# Altium schematic sheet power_switches.SchDoc
size A4
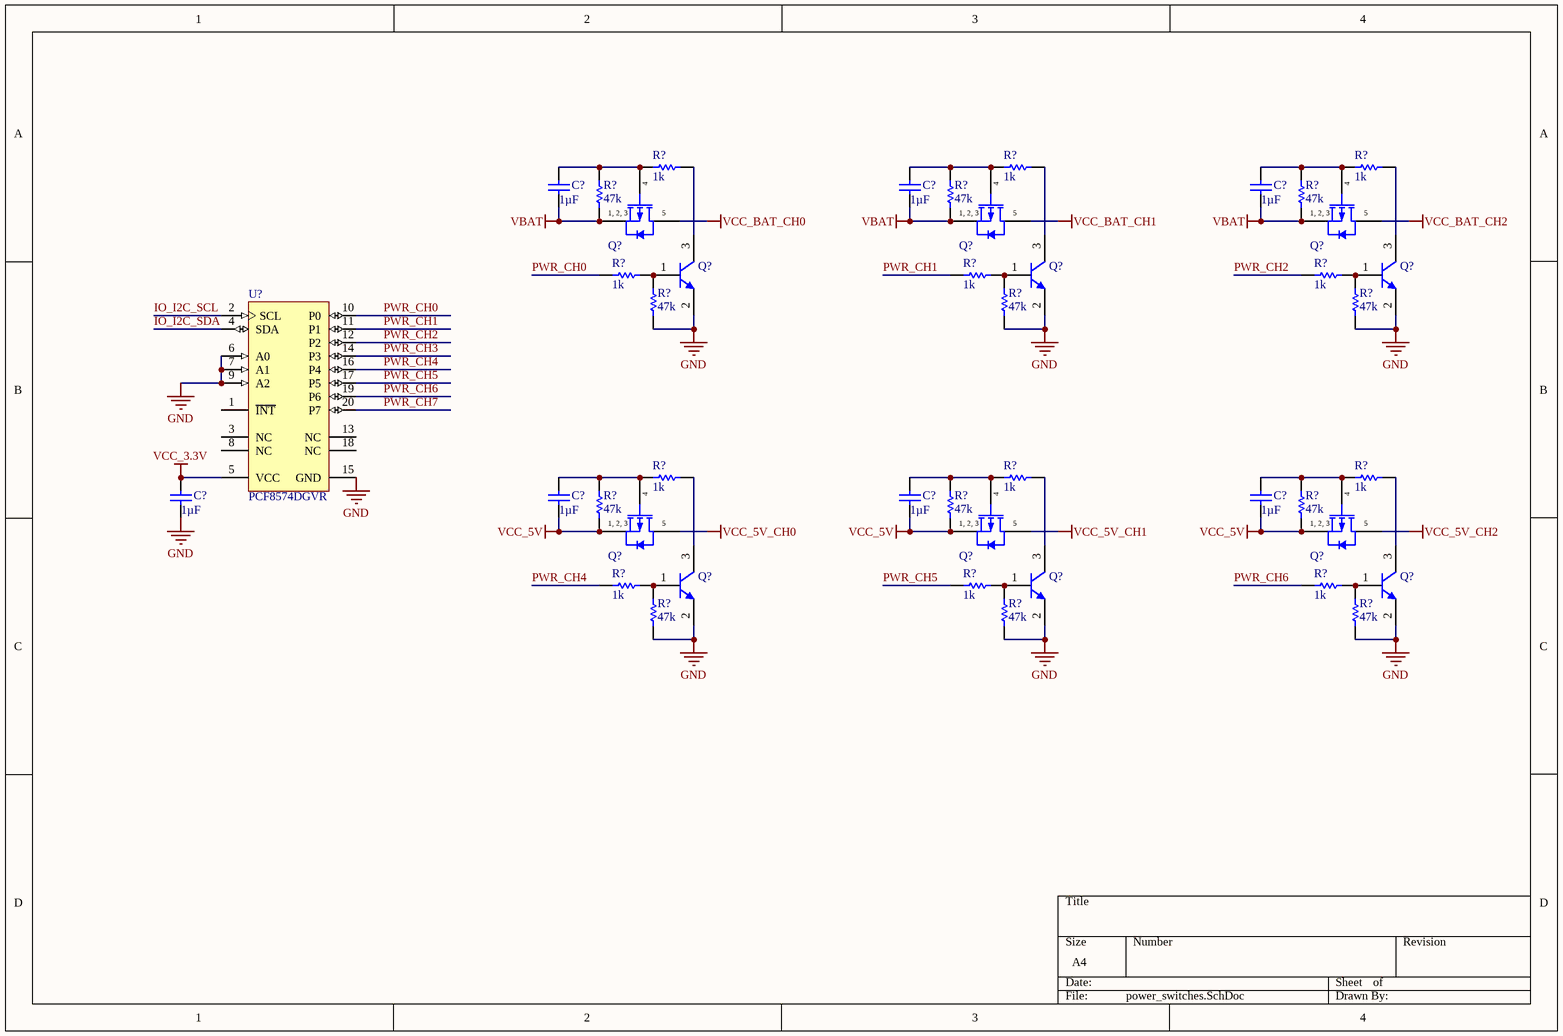
[diagram p0: power_switches.SchDoc]

## Parts
(Parts that share a designator on the sheet are numbered #1, #2 ... from top to bottom, then left to right.)
C?#1  1µF  [CAPC1608X90X35LL15T15]
C?#2  1µF  [CAPC1608X90X35LL15T15]
C?#3  1µF  [CAPC1608X90X35LL15T15]
C?#4  1µF  [CAPC1608X90X35LL15T15]
C?#5  1µF  [CAPC1608X90X35LL15T15]
C?#6  1µF  [CAPC1608X90X35LL15T15]
C?#7  1µF  [CAPC1608X90X35LL15T15]
Q?#1  Vishay SI7149ADP-T1-GE3  [PCB-zhz9tig7820limf6j70v-1]  (value not drawn)
Q?#2  Vishay SI7149ADP-T1-GE3  [PCB-zhz9tig7820limf6j70v-1]  (value not drawn)
Q?#3  Vishay SI7149ADP-T1-GE3  [PCB-zhz9tig7820limf6j70v-1]  (value not drawn)
Q?#4  SMMBT4401LT1G  [ONSC-SOT-23-3-318-08_V]  (value not drawn)
Q?#5  SMMBT4401LT1G  [ONSC-SOT-23-3-318-08_V]  (value not drawn)
Q?#6  SMMBT4401LT1G  [ONSC-SOT-23-3-318-08_V]  (value not drawn)
Q?#7  Vishay SI7149ADP-T1-GE3  [PCB-zhz9tig7820limf6j70v-1]  (value not drawn)
Q?#8  Vishay SI7149ADP-T1-GE3  [PCB-zhz9tig7820limf6j70v-1]  (value not drawn)
Q?#9  Vishay SI7149ADP-T1-GE3  [PCB-zhz9tig7820limf6j70v-1]  (value not drawn)
Q?#10  SMMBT4401LT1G  [ONSC-SOT-23-3-318-08_V]  (value not drawn)
Q?#11  SMMBT4401LT1G  [ONSC-SOT-23-3-318-08_V]  (value not drawn)
Q?#12  SMMBT4401LT1G  [ONSC-SOT-23-3-318-08_V]  (value not drawn)
R?#1  1k  [PCB-imsgvtunp3nvnj2wzwbs-1]
R?#2  1k  [PCB-imsgvtunp3nvnj2wzwbs-1]
R?#3  1k  [PCB-imsgvtunp3nvnj2wzwbs-1]
R?#4  47k  [RESC1005X40X25LL05T10]
R?#5  47k  [RESC1005X40X25LL05T10]
R?#6  47k  [RESC1005X40X25LL05T10]
R?#7  1k  [PCB-imsgvtunp3nvnj2wzwbs-1]
R?#8  1k  [PCB-imsgvtunp3nvnj2wzwbs-1]
R?#9  1k  [PCB-imsgvtunp3nvnj2wzwbs-1]
R?#10  47k  [RESC1005X40X25LL05T10]
R?#11  47k  [RESC1005X40X25LL05T10]
R?#12  47k  [RESC1005X40X25LL05T10]
R?#13  1k  [PCB-imsgvtunp3nvnj2wzwbs-1]
R?#14  1k  [PCB-imsgvtunp3nvnj2wzwbs-1]
R?#15  1k  [PCB-imsgvtunp3nvnj2wzwbs-1]
R?#16  47k  [RESC1005X40X25LL05T10]
R?#17  47k  [RESC1005X40X25LL05T10]
R?#18  47k  [RESC1005X40X25LL05T10]
R?#19  1k  [PCB-imsgvtunp3nvnj2wzwbs-1]
R?#20  1k  [PCB-imsgvtunp3nvnj2wzwbs-1]
R?#21  1k  [PCB-imsgvtunp3nvnj2wzwbs-1]
R?#22  47k  [RESC1005X40X25LL05T10]
R?#23  47k  [RESC1005X40X25LL05T10]
R?#24  47k  [RESC1005X40X25LL05T10]
U?  PCF8574DGVR  [DGV20_L]

## Nets
GND: C?#4.2 Q?#4.2(E) Q?#5.2(E) Q?#6.2(E) Q?#10.2(E) Q?#11.2(E) Q?#12.2(E) R?#10.1 R?#11.1 R?#12.1 R?#22.1 R?#23.1 R?#24.1 U?.6(A0) U?.7(A1) U?.9(A2) U?.15(GND)
VBAT: C?#1.2 C?#2.2 C?#3.2 Q?#1.S Q?#2.S Q?#3.S R?#4.1 R?#5.1 R?#6.1
VCC_3.3V: C?#4.1 U?.5(VCC)
VCC_5V: C?#5.2 C?#6.2 C?#7.2 Q?#7.S Q?#8.S Q?#9.S R?#16.1 R?#17.1 R?#18.1
VCC_5V_CH0: Q?#7.D
VCC_5V_CH1: Q?#8.D
VCC_5V_CH2: Q?#9.D
VCC_BAT_CH0: Q?#1.D
VCC_BAT_CH1: Q?#2.D
VCC_BAT_CH2: Q?#3.D
IO_I2C_SCL: U?.2(SCL)
IO_I2C_SDA: U?.4(SDA)
PWR_CH0: R?#7.1 U?.10(P0)
PWR_CH1: R?#8.1 U?.11(P1)
PWR_CH2: R?#9.1 U?.12(P2)
PWR_CH3: U?.14(P3)
PWR_CH4: R?#19.1 U?.16(P4)
PWR_CH5: R?#20.1 U?.17(P5)
PWR_CH6: R?#21.1 U?.19(P6)
PWR_CH7: U?.20(P7)
NetC?#1_1: C?#1.1 Q?#1.G R?#1.2 R?#4.2
NetC?#2_1: C?#2.1 Q?#2.G R?#2.2 R?#5.2
NetC?#3_1: C?#3.1 Q?#3.G R?#3.2 R?#6.2
NetC?#5_1: C?#5.1 Q?#7.G R?#13.2 R?#16.2
NetC?#6_1: C?#6.1 Q?#8.G R?#14.2 R?#17.2
NetC?#7_1: C?#7.1 Q?#9.G R?#15.2 R?#18.2
NetQ?#4_1: Q?#4.1(B) R?#7.2 R?#10.2
NetQ?#4_3: Q?#4.3(C) R?#1.1
NetQ?#5_1: Q?#5.1(B) R?#8.2 R?#11.2
NetQ?#5_3: Q?#5.3(C) R?#2.1
NetQ?#6_1: Q?#6.1(B) R?#9.2 R?#12.2
NetQ?#6_3: Q?#6.3(C) R?#3.1
NetQ?#10_1: Q?#10.1(B) R?#19.2 R?#22.2
NetQ?#10_3: Q?#10.3(C) R?#13.1
NetQ?#11_1: Q?#11.1(B) R?#20.2 R?#23.2
NetQ?#11_3: Q?#11.3(C) R?#14.1
NetQ?#12_1: Q?#12.1(B) R?#21.2 R?#24.2
NetQ?#12_3: Q?#12.3(C) R?#15.1

Not connected (* = marked no-connect by the designer): U? 1(~{INT}) 3(NC) 8(NC) 13(NC) 18(NC)

## Notes on the sheet
- (in symbol CMP-ebab2065408c346c-3) 4; 1, 2, 3; 5

## Library data of the parts
C?#1-C?#7 = CMP-f2f83b8d074c2d3f-6: 0603 1 uF 16 V ±10 % Tolerance X5R SMT Multilayer Ceramic Capacitor; Capacitance Tolerance: ±10%; Lead-Free Status: Lead Free; Voltage Rating (DC): 16.0 V; Dielectric Characteristic: X5R; Mounting Style: Surface Mount; OctopartID: f2f83b8d074c2d3f
Q?#1-Q?#3 Q?#7-Q?#9 = CMP-ebab2065408c346c-3: Si7149ADP Series 30 V 50 A 50 mOhm Surface Mount P-Channel Mosfet-PowerPAK SO-8
Q?#4-Q?#6 Q?#10-Q?#12 = CMP-860861-2: Switching Transistor, NPN Silicon, 3-Pin SOT-23, Pb-Free, Tape and Reel; Lead-Free Status: Lead Free; Lifecycle Status: Active; Octopart Url: https://octopart.com/smmbt4401lt1g-on+semiconductor-17512939; OctopartID: 7accb2cd6641a50b; RoHS: Compliant; Manufacturer Part Number: SMMBT4401LT1G
R?#1-R?#3 R?#7-R?#9 R?#13-R?#15 R?#19-R?#21 = CMP-56d29ab4a6068915-1: Res Thick Film 0402 1K Ohm 1% 0.125W(1/8W) ±100ppm/C Pad SMD T/R; Manufacturer Part Number: CRGP0402F1K0; Resistance Tolerance: ±1%
R?#4-R?#6 R?#10-R?#12 R?#16-R?#18 R?#22-R?#24 = CMP-1859043-2: Thick Film Resistors - SMD 1/8watt 47Kohms 1% 100ppm High Power; Manufacturer Part Number: CRCW040247K0FKEDHP; Lead-Free Status: Lead Free; Power Rating: 0.063 W; Resistance: 47000.0 Ω; Case/Package: 0402; Octopart Url: https://octopart.com/crcw040247k0fkedhp-vishay+dale-44383189; OctopartID: 3aaef101241de569; Resistance Tolerance: ±1%; RoHS: Compliant
U? = CMP-4873507-2: Remote 8-Bit I/O Expander for I2C-Bus, 2.5 to 6 V, -40 to 85 degC, 20-pin TVSOP (DGV), Green (RoHS & no Sb/Br); Lead-Free Status: Lead Free; Number of Outputs: 8; Manufacturer Part Number: PCF8574DGVR; Case/Package: TVSOP; Lifecycle Status: Active; Mounting Style: Surface Mount; Octopart Url: https://octopart.com/pcf8574dgvr-texas+instruments-469516; OctopartID: b39b7a96bcf16c5c; Packaging: Reel; RoHS: Compliant